# Altium schematic sheet LM3478.SchDoc: LM3478 High Voltage PWM Controller
size A4; Organization: Altium Limited; Revision: 1.0; SheetNumber: 1; SheetTotal: 1
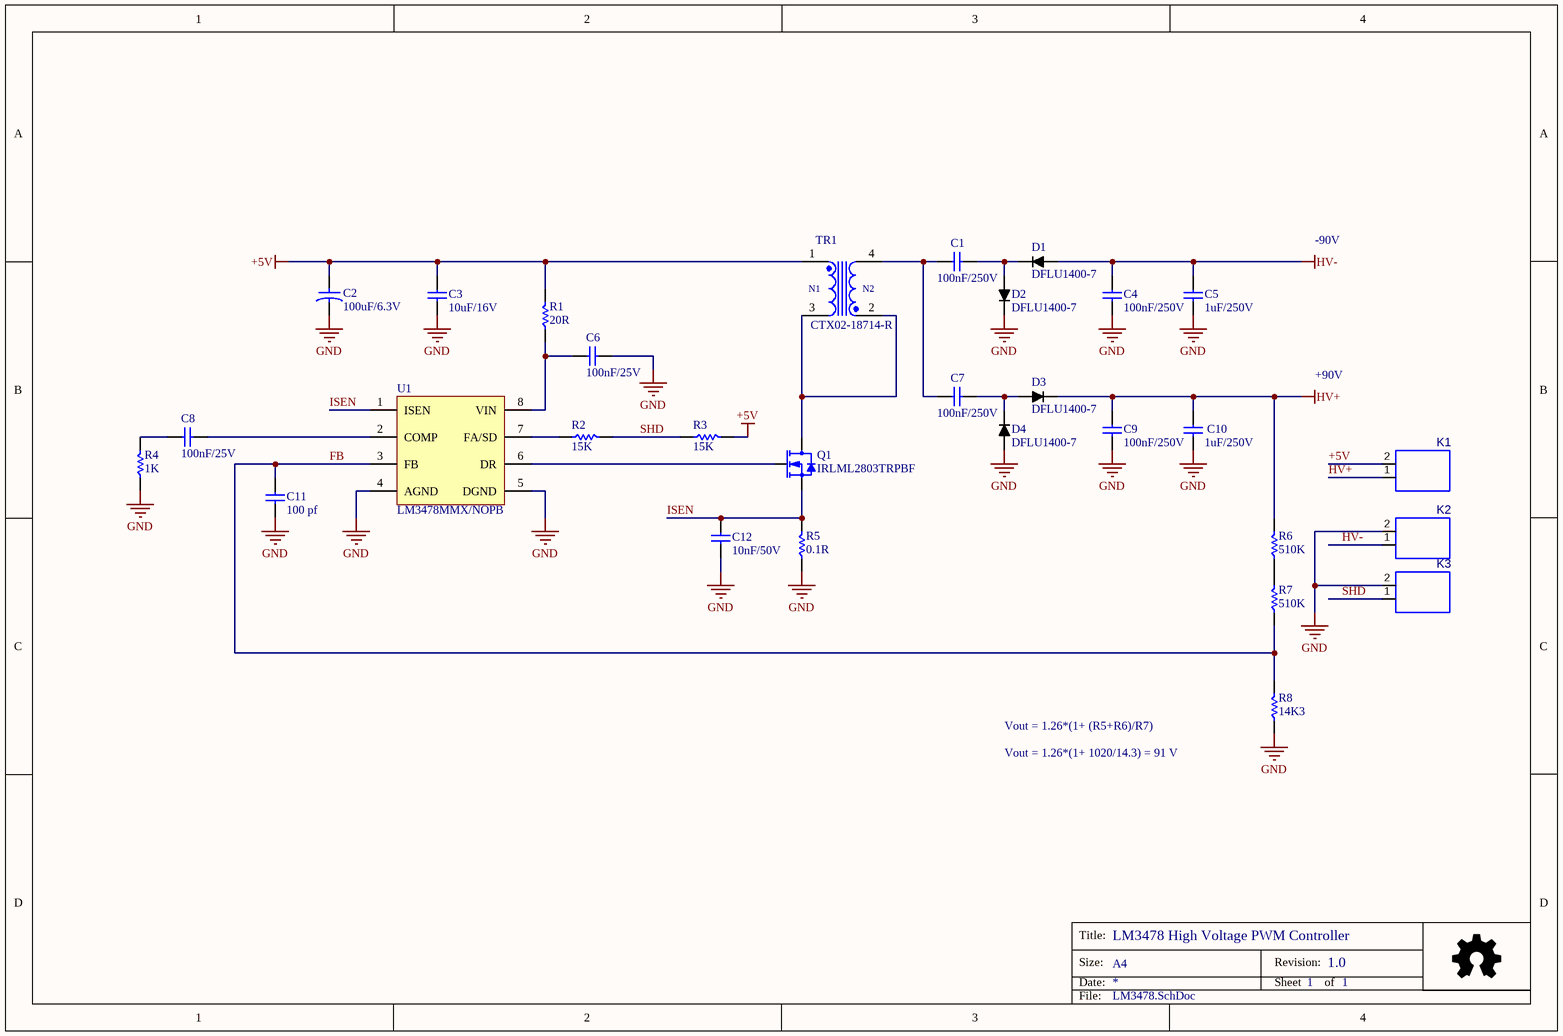
[diagram p0: LM3478.SchDoc]

## Parts
C1  100nF/250V  [CAP 0805/2012]
C2  100uF/6.3V  [CAP CASE C]
C3  10uF/16V  [CAP 1206/3216]
C4  100nF/250V  [CAP 0805/2012]
C5  1uF/250V  [CAP 2220/5650]
C6  100nF/25V  [CAP 0805/2012]
C7  100nF/250V  [CAP 0805/2012]
C8  100nF/25V  [CAP 0805/2012]
C9  100nF/250V  [CAP 0805/2012]
C10  1uF/250V  [CAP 2220/5650]
C11  100 pf  [CAP 0805/2012]
C12  10nF/50V  [CAP 0805/2012]
D1  DFLU1400-7  [POWERDI-123]
D2  DFLU1400-7  [POWERDI-123]
D3  DFLU1400-7  [POWERDI-123]
D4  DFLU1400-7  [POWERDI-123]
K1  1x2PLS  [JUMPER2]  (value not drawn)
K2  1x2PLS  [JUMPER2]  (value not drawn)
K3  1x2PLS  [JUMPER2]  (value not drawn)
Q1  IRLML2803TRPBF  [SOT-23-3]
R1  20R  [RES 0805/2012]
R2  15K  [RES 0805/2012]
R3  15K  [RES 0805/2012]
R4  1K  [RES 0805/2012]
R5  0.1R  [RES 0805/2012]
R6  510K  [RES 0805/2012]
R7  510K  [RES 0805/2012]
R8  14K3  [RES 0805/2012]
TR1  CTX02-18714-R  [CTX02-18714-R]
U1  LM3478MMX/NOPB  [MSOP-8]

## Nets
+5V: C2.1 C3.2 K1.2 R1.2 R3.2 TR1.1
GND: C2.2 C3.1 C4.1 C5.1 C6.2 C9.1 C10.1 C11.1 C12.1 D2.1(K) D4.2(A) K2.2 K3.2 R4.1 R5.1 R8.1 U1.4(AGND) U1.5(DGND)
HV+: C9.2 C10.2 D3.1(K) K1.1 R6.2
HV-: C4.2 C5.2 D1.2(A) K2.1
FB: C11.2 R7.1 R8.2 U1.3(FB)
ISEN: C12.2 Q1.2(S) R5.2 U1.1(ISEN)
SHD: K3.1 R2.2 R3.1
NetC1_1: C1.1 C7.1 TR1.4
NetC1_2: C1.2 D1.1(K) D2.2(A)
NetC6_1: C6.1 R1.1 U1.8(VIN)
NetC7_2: C7.2 D3.2(A) D4.1(K)
NetC8_1: C8.1 R4.2
NetC8_2: C8.2 U1.2(COMP)
NetQ1_1: Q1.1(G) U1.6(DR)
NetQ1_3: Q1.3(D) TR1.2 TR1.3
NetR2_1: R2.1 U1.7(FA/SD)
NetR6_1: R6.1 R7.2

## Notes on the sheet
- -90V
- +90V
- Vout = 1.26*(1+ (R5+R6)/R7)
- Vout = 1.26*(1+ 1020/14.3) = 91 V
- Title:
- Size:
- Date:
- A4
- Revision:
- Sheet
- of
- File:
- (in symbol CTX02-18714-R) N1; N2

## Library data of the parts
C1 C4 C7 C9 = CGA4J3X7T2E104K125AA: CAPACITOR 0805 100nF 250V, 10%, X7T; Manufacturer: TDK; Supplier 1: Farnell; Manufacturer Part Number: CGA4J3X7T2E104K125AA; Stock 1: 100000; Pricing 1: 2000=0.0796, 10000=0.0668 (EUR); Mount: Surface Mount; Case/Package: 0805; Weight: 0.000194oz; Case Code (Imperial): 0805; Case Code (Metric): 2012; Min Operating Temperature: -55°C; Max Operating Temperature: 125°C; Capacitance: 100nF; Tolerance: 10%; Dielectric: X7T; Termination: SMD/SMT; Voltage Rating (DC): 250V; Packaging: Tape and Reel; Voltage Rating: 250V; Package Quantity: 2000; Composition: Ceramic; Length: 2mm; Height: 1.25mm; Width: 1.25mm; Thickness: 0.057inch; Depth: 1.25mm; Ratings: AEC-Q200; Radiation Hardening: No; REACH SVHC: No SVHC; ComponentLink1URL: http://www.farnell.com/datasheets/1807242.pdf?src-supplier=Element14; ComponentLink1Description: http://www.farnell.com/datasheets/1807242.pdf?src-supplier=Element14; Value: 100nF/250V
C2 = TPSC107M006R0150: CAPACITOR 100uF 2312 6V3 TANT; Manufacturer: Kyocera AVX; Dielectric Material: Tantalum; Tolerance: 20%; ESR (Equivalent Series Resistance): 150mR; Voltage Rating: 6.3V; Leakage Current: 6.3uA; Polarity: Polar; Dissipation Factor: 6%; Supplier 1: Mouser; Manufacturer Part Number: TPSC107M006R0150; Stock 1: 4254; Pricing 1: 1=1.7, 10=1.16, 50=1.16, 100=0.896, 1000=0.6, 10000=0.51 (USD); Mount: Surface Mount,PCB; Case/Package: Molded; Case Code (Imperial): 2312; Case Code (Metric): 6032; Min Operating Temperature: -55°C; Max Operating Temperature: 125°C; Capacitance: 100uF; Packaging: Tape and Reel; Voltage Rating (DC): 6.3V; Package Quantity: 1; Termination: SMD/SMT; Voltage: 6.3V; Features: General Purpose; Length: 6mm; Height: 2.6mm; Width: 3.2mm; Depth: 3.2mm; Height - Seated (Max): 0.11inch; Lead Pitch: 2.9mm; Radiation Hardening: No; REACH SVHC: No SVHC; Lead Free: Lead Free; ComponentLink1URL: http://www.jameco.com/Jameco/Products/ProdDS/1938607.pdf?src-supplier=Jameco; ComponentLink1Description: http://www.jameco.com/Jameco/Products/ProdDS/1938607.pdf?src-supplier=Jameco; ComponentLink2URL: http://www.mouser.com/ds/2/40/tps-776850.pdf?src-supplier=Mouser; ComponentLink2Description: http://www.mouser.com/ds/2/40/tps-776850.pdf?src-supplier=Mouser; ComponentLink3URL: https://www.alliedelec.com/m/d/83cf44e04b230909adf636c7cda0f956.pdf?src-supplier=Allied+Electronics; ComponentLink3Description: https://www.alliedelec.com/m/d/83cf44e04b230909adf636c7cda0f956.pdf?src-supplier=Allied+Electronics; ComponentLink4URL: http://www.avx.com/docs/catalogs/tps.pdf?src-supplier=Avnet+Europe; ComponentLink4Description: http://www.avx.com/docs/catalogs/tps.pdf?src-supplier=Avnet+Europe; ComponentLink5URL: http://www.avx.com/docs/catalogs/tps.pdf?src-supplier=Avnet; ComponentLink5Description: http://www.avx.com/docs/catalogs/tps.pdf?src-supplier=Avnet; ComponentLink6URL: https://www.verical.com/server-webapp/html/getDatasheet?partID=92459&src-supplier=Verical; ComponentLink6Description: https://www.verical.com/server-webapp/html/getDatasheet?partID=92459&src-supplier=Verical; ComponentLink7URL: http://datasheets.avx.com/TPS.pdf?src-supplier=Digi-Key; ComponentLink7Description: http://datasheets.avx.com/TPS.pdf?src-supplier=Digi-Key; ComponentLink8URL: http://www.avxcorp.com/docs/Catalogs/tps.pdf?src-supplier=Future+Electronics; ComponentLink8Description: http://www.avxcorp.com/docs/Catalogs/tps.pdf?src-supplier=Future+Electronics; Value: 100uF/6.3V
C3 = GCM31CR71C106KA64L: CAPACITOR 1206 10uF 16V X7R 10%; Manufacturer: Murata; Supplier 1: Farnell; Manufacturer Part Number: GCM31CR71C106KA64L; Stock 1: 0; Pricing 1: 150=0.579, 250=0.528, 500=0.424 (EUR); Mount: Surface Mount; Case/Package: 1206; Case Code (Metric): 3216; Case Code (Imperial): 1206; Min Operating Temperature: -55°C; Max Operating Temperature: 125°C; Capacitance: 10uF; Tolerance: 10%; Dielectric: X7R; Packaging: Tape and Reel; Package Quantity: 1; Voltage Rating: 16V; Voltage Rating (DC): 16V; Termination: SMD/SMT; Voltage: 16V; Length: 3.2mm; Height: 1.6mm; Width: 0.063inch; Thickness: 0.071inch; Depth: 1.6mm; Ratings: AEC-Q200; Radiation Hardening: No; REACH SVHC: No SVHC; Lead Free: Lead Free; ComponentLink1URL: http://psearch.murata.com/capacitor/product/GCM31CR71C106KA64%23.pdf?src-supplier=Avnet; ComponentLink1Description: http://psearch.murata.com/capacitor/product/GCM31CR71C106KA64%23.pdf?src-supplier=Avnet; ComponentLink2URL: http://search.murata.co.jp/Ceramy/image/img/A01X/partnumbering_e_02.pdf?src-supplier=Digi-Key; ComponentLink2Description: http://search.murata.co.jp/Ceramy/image/img/A01X/partnumbering_e_02.pdf?src-supplier=Digi-Key; ComponentLink3URL: http://psearch.murata.com/capacitor/product/GCM31CR71C106KA64%23.pdf?src-supplier=Future+Electronics; ComponentLink3Description: http://psearch.murata.com/capacitor/product/GCM31CR71C106KA64%23.pdf?src-supplier=Future+Electronics; ComponentLink4URL: http://psearch.murata.com/capacitor/product/GCM31CR71C106KA64%23.pdf?src-supplier=Avnet+Europe; ComponentLink4Description: http://psearch.murata.com/capacitor/product/GCM31CR71C106KA64%23.pdf?src-supplier=Avnet+Europe; ComponentLink5URL: https://www.verical.com/server-webapp/html/getDatasheet?partID=153103&src-supplier=Verical; ComponentLink5Description: https://www.verical.com/server-webapp/html/getDatasheet?partID=153103&src-supplier=Verical; Value: 10uF/16V
C5 C10 = GRM55DR72E105KW01L: CAPACITOR 2220 1uF 250V X7R; Manufacturer: Murata; Material: Ceramic; Tolerance: 10%; Supplier 1: Farnell; Manufacturer Part Number: GRM55DR72E105KW01L; Stock 1: 0; Pricing 1: 1000=0.4 (EUR); Mount: Surface Mount; Case/Package: 2220; Number of Pins: 2; Case Code (Imperial): 2220; Case Code (Metric): 5750; Min Operating Temperature: -55°C; Max Operating Temperature: 125°C; Capacitance: 1uF; Dielectric: X7R; Voltage Rating: 250V; Packaging: Tape and Reel; Voltage Rating (DC): 250V; Package Quantity: 1; Termination: SMD/SMT; Voltage: 250V; Length: 5.7mm; Height: 2mm; Depth: 5mm; Width: 5mm; Thickness: 0.087inch; REACH SVHC: No SVHC; Lead Free: Lead Free; ComponentLink1URL: http://uk.rs-online.com/webdocs/1423/0900766b81423c41.pdf?src-supplier=RSComponents; ComponentLink1Description: http://uk.rs-online.com/webdocs/1423/0900766b81423c41.pdf?src-supplier=RSComponents; ComponentLink2URL: http://www.farnell.com/datasheets/608985.pdf?src-supplier=Element14; ComponentLink2Description: http://www.farnell.com/datasheets/608985.pdf?src-supplier=Element14; ComponentLink3URL: http://www.jameco.com/Jameco/Products/ProdDS/1859917.pdf?src-supplier=Jameco; ComponentLink3Description: http://www.jameco.com/Jameco/Products/ProdDS/1859917.pdf?src-supplier=Jameco; ComponentLink4URL: http://components.arrow.com/part/dataview/41900306S9850866N2606?src-supplier=Arrow; ComponentLink4Description: http://components.arrow.com/part/dataview/41900306S9850866N2606?src-supplier=Arrow; ComponentLink5URL: http://search.murata.co.jp/Ceramy/image/img/w_hinm/L0005E.pdf?src-supplier=Future+Electronics; ComponentLink5Description: http://search.murata.co.jp/Ceramy/image/img/w_hinm/L0005E.pdf?src-supplier=Future+Electronics; ComponentLink6URL: http://search.murata.co.jp/Ceramy/image/img/A01X/G101/ENG/GRM55DR72E105KW01-01.pdf?src-supplier=Digi-Key; ComponentLink6Description: http://search.murata.co.jp/Ceramy/image/img/A01X/G101/ENG/GRM55DR72E105KW01-01.pdf?src-supplier=Digi-Key; ComponentLink7URL: https://produktinfo.conrad.com/datenblaetter/450000-474999/452001-da-01-de-VS_KONDENS_GRM55_DR72E_105KW01L.pdf?src-supplier=Conrad; ComponentLink7Description: https://produktinfo.conrad.com/datenblaetter/450000-474999/452001-da-01-de-VS_KONDENS_GRM55_DR72E_105KW01L.pdf?src-supplier=Conrad; Value: 1uF/250V
C6 C8 = GRM21BR71E104KA01L: CAPACITOR 0805 100nF 25V X7R 10%; Manufacturer: Murata; Supplier 1: Farnell; Manufacturer Part Number: GRM21BR71E104KA01L; Stock 1: 0; Mount: Surface Mount; Case/Package: 0805; Number of Pins: 2; Weight: 0.000194oz; Case Code (Imperial): 0805; Case Code (Metric): 2012; Min Operating Temperature: -55°C; Max Operating Temperature: 125°C; Capacitance: 100nF; Tolerance: 10%; Dielectric: X7R; Voltage Rating: 25V; Voltage Rating (DC): 25V; Packaging: Tape and Reel; Package Quantity: 1; Termination: SMD/SMT; Voltage: 25V; Length: 2mm; Height: 1.25mm; Width: 1.25mm; Thickness: 0.053inch; Depth: 1.25mm; Radiation Hardening: No; REACH SVHC: No SVHC; Lead Free: Lead Free; ComponentLink1URL: http://psearch.murata.com/capacitor/product/GRM21BR71E104KA01%23.pdf?src-supplier=Future+Electronics; ComponentLink1Description: http://psearch.murata.com/capacitor/product/GRM21BR71E104KA01%23.pdf?src-supplier=Future+Electronics; ComponentLink2URL: https://search.murata.co.jp/Ceramy/image/img/A01X/G101/ENG/GRM21BR71E104KA01-01.pdf?src-supplier=Digi-Key; ComponentLink2Description: https://search.murata.co.jp/Ceramy/image/img/A01X/G101/ENG/GRM21BR71E104KA01-01.pdf?src-supplier=Digi-Key; ComponentLink3URL: http://www.farnell.com/datasheets/608985.pdf?src-supplier=Element14; ComponentLink3Description: http://www.farnell.com/datasheets/608985.pdf?src-supplier=Element14; ComponentLink4URL: http://components.arrow.com/part/dataview/5434837S9850839N2606?src-supplier=Arrow; ComponentLink4Description: http://components.arrow.com/part/dataview/5434837S9850839N2606?src-supplier=Arrow; ComponentLink5URL: http://uk.rs-online.com/webdocs/1423/0900766b81423cc8.pdf?src-supplier=RSComponents; ComponentLink5Description: http://uk.rs-online.com/webdocs/1423/0900766b81423cc8.pdf?src-supplier=RSComponents; Value: 100nF/25V
C11 = GRM216R71H102KA01D: CAPACITOR 0805 1nF 50V X7R 10%; Manufacturer: Murata; Material: Ceramic; Value: 1nF/50V; Supplier 1: Farnell; Manufacturer Part Number: GRM216R71H102KA01D; Stock 1: 0; Mount: Surface Mount; Case/Package: 0805; Number of Pins: 2; Case Code (Imperial): 0805; Case Code (Metric): 2012; Min Operating Temperature: -55°C; Max Operating Temperature: 125°C; Capacitance: 1nF; Tolerance: 10%; Dielectric: X7R; Voltage Rating: 50V; Voltage Rating (DC): 50V; Packaging: Tape and Reel; Package Quantity: 4000; Termination: SMD/SMT; Voltage: 50V; Length: 2mm; Height: 0.6mm; Depth: 1.25mm; Width: 1.25mm; Thickness: 0.028inch; Radiation Hardening: No; REACH SVHC: No SVHC; Lead Free: Lead Free; ComponentLink1URL: http://www1.futureelectronics.com/doc/Murata/murata%20GRM216R71H102KA01D.pdf?src-supplier=Future+Electronics; ComponentLink1Description: http://www1.futureelectronics.com/doc/Murata/murata%20GRM216R71H102KA01D.pdf?src-supplier=Future+Electronics; ComponentLink2URL: http://www.rapidonline.com/pdf/71-2004.pdf?src-supplier=Rapid+Electronics; ComponentLink2Description: http://www.rapidonline.com/pdf/71-2004.pdf?src-supplier=Rapid+Electronics; ComponentLink3URL: https://www.murata.com/~/media/webrenewal/support/library/catalog/products/capacitor/mlcc/c02e.ashx?la=en-us&src-supplier=Digi-Key; ComponentLink3Description: https://www.murata.com/~/media/webrenewal/support/library/catalog/products/capacitor/mlcc/c02e.ashx?la=en-us&src-supplier=Digi-Key; ComponentLink4URL: https://www.distrelec.biz/Web/Downloads/_t/ds/murata_MLCC_eng_tds.pdf?mime=application%2Fpdf&src-supplier=Distrelec; ComponentLink4Description: https://www.distrelec.biz/Web/Downloads/_t/ds/murata_MLCC_eng_tds.pdf?mime=application%2Fpdf&src-supplier=Distrelec; ComponentLink5URL: http://www.murata.com/~/media/webrenewal/support/library/catalog/products/capacitor/mlcc/c02e.ashx?src-supplier=Avnet; ComponentLink5Description: http://www.murata.com/~/media/webrenewal/support/library/catalog/products/capacitor/mlcc/c02e.ashx?src-supplier=Avnet; ComponentLink6URL: http://www.murata.com/products/catalog/pdf/c02e.pdf?src-supplier=Avnet; ComponentLink6Description: http://www.murata.com/products/catalog/pdf/c02e.pdf?src-supplier=Avnet; ComponentLink7URL: http://search.murata.co.jp/Ceramy/image/img/A01X/partnumbering_e_01.pdf?src-supplier=Digi-Key; ComponentLink7Description: http://search.murata.co.jp/Ceramy/image/img/A01X/partnumbering_e_01.pdf?src-supplier=Digi-Key; ComponentLink8URL: http://www.murata.com/products/catalog/pdf/c02e.pdf?src-supplier=Avnet+Europe; ComponentLink8Description: http://www.murata.com/products/catalog/pdf/c02e.pdf?src-supplier=Avnet+Europe; ComponentLink9URL: http://components.arrow.com/part/dataview/40420870S3442898N2606?src-supplier=Arrow; ComponentLink9Description: http://components.arrow.com/part/dataview/40420870S3442898N2606?src-supplier=Arrow; ComponentLink10URL: http://www.farnell.com/datasheets/2048646.pdf?src-supplier=Element14; ComponentLink10Description: http://www.farnell.com/datasheets/2048646.pdf?src-supplier=Element14; ComponentLink11URL: https://produktinfo.conrad.com/datenblaetter/450000-474999/452509-da-01-en-VS_KONDENSATOR_0805.pdf?src-supplier=Conrad; ComponentLink11Description: https://produktinfo.conrad.com/datenblaetter/450000-474999/452509-da-01-en-VS_KONDENSATOR_0805.pdf?src-supplier=Conrad
C12 = GRM216R71H103JA01D: CAPACITOR 0805 10nF 50V X7R 5%; Manufacturer: Murata; Dielectric Material: Ceramic; Insulation Resistance: 10GR; Supplier 1: Farnell; Manufacturer Part Number: GRM216R71H103JA01D; Stock 1: 0; Mount: Surface Mount; Case/Package: 0805; Number of Pins: 2; Case Code (Imperial): 0805; Case Code (Metric): 2012; Min Operating Temperature: -55°C; Max Operating Temperature: 125°C; Capacitance: 10nF; Tolerance: 5%; Dielectric: X7R; Voltage Rating: 50V; Packaging: Tape and Reel; Voltage Rating (DC): 50V; Package Quantity: 4000; Termination: SMD/SMT; Voltage: 50V; Length: 2mm; Height: 0.6mm; Depth: 1.25mm; Width: 1.25mm; Thickness: 0.028inch; Radiation Hardening: No; REACH SVHC: No SVHC; Lead Free: Lead Free; ComponentLink1URL: http://www.mouser.com/ds/2/281/c02e-2905.pdf?src-supplier=Mouser; ComponentLink1Description: http://www.mouser.com/ds/2/281/c02e-2905.pdf?src-supplier=Mouser; ComponentLink2URL: http://search.murata.co.jp/Ceramy/image/img/A01X/partnumbering_e_01.pdf?src-supplier=Digi-Key; ComponentLink2Description: http://search.murata.co.jp/Ceramy/image/img/A01X/partnumbering_e_01.pdf?src-supplier=Digi-Key; ComponentLink3URL: http://components.arrow.com/part/dataview/5432629S9717172N2606?src-supplier=Arrow; ComponentLink3Description: http://components.arrow.com/part/dataview/5432629S9717172N2606?src-supplier=Arrow; ComponentLink4URL: https://www.murata.com/~/media/webrenewal/support/library/catalog/products/capacitor/mlcc/c02e.ashx?la=en-us&src-supplier=Digi-Key; ComponentLink4Description: https://www.murata.com/~/media/webrenewal/support/library/catalog/products/capacitor/mlcc/c02e.ashx?la=en-us&src-supplier=Digi-Key; ComponentLink5URL: http://www.farnell.com/datasheets/4360.pdf?src-supplier=Element14; ComponentLink5Description: http://www.farnell.com/datasheets/4360.pdf?src-supplier=Element14; Value: 10nF/50V
D1-D4 = DFLU1400-7: DIODE 400V 1A POWERDI123; Manufacturer: Diodes; Peak Reverse Current: 5uA; Reverse Recovery Time: 25ns; Peak Non-Repetitive Surge Current: 30A; Element Configuration: Single; Forward Voltage: 1.25V; Max Power Dissipation: 1W; Polarity: Standard; Capacitance: 14pF; Supplier 1: Farnell; Manufacturer Part Number: DFLU1400-7; Stock 1: 0; Pricing 1: 150=0.192, 250=0.17, 500=0.148, 1000=0.126, 5000=0.124 (EUR); Mount: Surface Mount; Number of Pins: 2; Weight: 0.000353oz; Contact Plating: Tin,Matte; Min Operating Temperature: -65°C; Max Operating Temperature: 150°C; Forward Current: 1A; Max Repetitive Reverse Voltage (Vrrm): 400V; Max Surge Current: 30A; Packaging: Tape and Reel; Package Quantity: 3000; Recovery Time: 25ns; Reverse Voltage (DC): 400V; Average Rectified Current: 1A; Max Forward Surge Current (Ifsm): 30A; Voltage Rating (DC): 400V; Current Rating: 1A; Output Current: 1A; Max Reverse Voltage (DC): 400V; Length: 2.8mm; Height: 0.98mm; Width: 1.78mm; Radiation Hardening: No; REACH SVHC: No SVHC; Lead Free: Lead Free; ComponentLink1URL: http://www.diodes.com///datasheets/ds30784.pdf?src-supplier=Avnet+Europe; ComponentLink1Description: http://www.diodes.com///datasheets/ds30784.pdf?src-supplier=Avnet+Europe; ComponentLink2URL: http://www.mouser.com/ds/2/115/ds30784-86750.pdf?src-supplier=Mouser; ComponentLink2Description: http://www.mouser.com/ds/2/115/ds30784-86750.pdf?src-supplier=Mouser; ComponentLink3URL: http://www.diodes.com///datasheets/ds30784.pdf?src-supplier=Avnet; ComponentLink3Description: http://www.diodes.com///datasheets/ds30784.pdf?src-supplier=Avnet; ComponentLink4URL: https://www.diodes.com/assets/Datasheets/ds30784.pdf?src-supplier=Digi-Key; ComponentLink4Description: https://www.diodes.com/assets/Datasheets/ds30784.pdf?src-supplier=Digi-Key; ComponentLink5URL: http://www.diodes.com/_files/datasheets/ds30784.pdf?src-supplier=Future+Electronics; ComponentLink5Description: http://www.diodes.com/_files/datasheets/ds30784.pdf?src-supplier=Future+Electronics
Q1 = IRLML2803TRPBF: MOSFET N-CH 30V 1.2A 3-Pin SOT-23 T/R; Manufacturer: International Rectifier; Gate to Source Voltage (Vgs): 20V; Rise Time: 4ns; Turn-On Delay Time: 3.9ns; Turn-Off Delay Time: 9ns; Fall Time: 1.7ns; Nominal Vgs: 1V; Rds On Max: 250mR; Input Capacitance: 85pF; Number of Elements: 1; Max Power Dissipation: 540mW; Drain to Source Resistance: 400mR; Element Configuration: Single; Supplier 1: Farnell; Manufacturer Part Number: IRLML2803TRPBF; Stock 1: 0; Mount: Surface Mount; Case/Package: SOT-23; Number of Pins: 3; Min Operating Temperature: -55°C; Max Operating Temperature: 150°C; Continuous Drain Current (ID): 1.2A; Drain to Source Voltage (Vdss): 30V; Packaging: Tape and Reel; Package Quantity: 1; Dual Supply Voltage: 30V; Drain to Source Breakdown Voltage: 30V; Power Dissipation: 540mW; On-State Resistance: 250mR; Min Breakdown Voltage: 30V; Termination: SMD/SMT; Threshold Voltage: 1V; Voltage Rating (DC): 30V; Current Rating: 1.2A; Length: 3.04mm; Height: 1.02mm; Width: 1.4mm; Radiation Hardening: No; Lead Free: Lead Free; REACH SVHC: No SVHC; ComponentLink1URL: http://www.jameco.com/Jameco/Products/ProdDS/1563665.pdf?src-supplier=Jameco; ComponentLink1Description: http://www.jameco.com/Jameco/Products/ProdDS/1563665.pdf?src-supplier=Jameco; ComponentLink2URL: http://www.irf.com/product-info/datasheets/data/irlml2803pbf.pdf?src-supplier=Future+Electronics; ComponentLink2Description: http://www.irf.com/product-info/datasheets/data/irlml2803pbf.pdf?src-supplier=Future+Electronics; ComponentLink3URL: http://www.irf.com/product-info/datasheets/data/irlml2803pbf.pdf?src-supplier=Digi-Key; ComponentLink3Description: http://www.irf.com/product-info/datasheets/data/irlml2803pbf.pdf?src-supplier=Digi-Key; ComponentLink4URL: https://www.infineon.com/dgdl/irlml2803pbf.pdf?fileId=5546d462533600a4015356682aff260f&src-supplier=Digi-Key; ComponentLink4Description: https://www.infineon.com/dgdl/irlml2803pbf.pdf?fileId=5546d462533600a4015356682aff260f&src-supplier=Digi-Key; ComponentLink5URL: http://www.irf.com/product-info/datasheets/data/irlml2803pbf.pdf?src-supplier=Farnell; ComponentLink5Description: http://www.irf.com/product-info/datasheets/data/irlml2803pbf.pdf?src-supplier=Farnell; ComponentLink6URL: http://www.produktinfo.conrad.com/datenblaetter/150000-174999/162828-da-01-en-IRLML_2803TR.pdf?src-supplier=Conrad; ComponentLink6Description: http://www.produktinfo.conrad.com/datenblaetter/150000-174999/162828-da-01-en-IRLML_2803TR.pdf?src-supplier=Conrad
R1 = ERJ6ENF20R0V: RESISTOR 0805 20R 1%; Manufacturer: Panasonic; Manufacturer Part Number: ERJ-6ENF20R0V; Temperature Coefficient: 100ppm/°C; Power Rating: 125mW; Voltage Rating: 150V; Supplier 1: Farnell; Stock 1: 0; Mount: Surface Mount; Case/Package: 0805; Weight: 0.000194oz; Contact Plating: Tin; Case Code (Metric): 2012; Case Code (Imperial): 0805; Min Operating Temperature: -55°C; Max Operating Temperature: 155°C; Resistance: 20R; Tolerance: 1%; Composition: Thick Film; Packaging: Tape and Reel; Package Quantity: 5000; Number of Terminations: 2; Termination: SMD/SMT; Military Standard: Not; Max Power Dissipation: 125mW; Length: 2mm; Height: 0.6mm; Width: 0.049inch; Depth: 1.25mm; Radiation Hardening: No; REACH SVHC: No SVHC; ComponentLink1URL: http://industrial.panasonic.com/www-data/pdf/AOA0000/AOA0000CE2.pdf?src-supplier=Avnet+Asia; ComponentLink1Description: http://industrial.panasonic.com/www-data/pdf/AOA0000/AOA0000CE2.pdf?src-supplier=Avnet+Asia; ComponentLink2URL: http://www.alliedelec.com/m/d/623f45ff1957d936ff56d46fd1c28cac.pdf?src-supplier=Allied+Electronics; ComponentLink2Description: http://www.alliedelec.com/m/d/623f45ff1957d936ff56d46fd1c28cac.pdf?src-supplier=Allied+Electronics; ComponentLink3URL: http://www.mouser.com/ds/2/315/AOA0000C86-911473.pdf?src-supplier=Mouser; ComponentLink3Description: http://www.mouser.com/ds/2/315/AOA0000C86-911473.pdf?src-supplier=Mouser; ComponentLink4URL: http://industrial.panasonic.com/www-data/pdf/AOA0000/AOA0000CE2.pdf?src-supplier=Avnet; ComponentLink4Description: http://industrial.panasonic.com/www-data/pdf/AOA0000/AOA0000CE2.pdf?src-supplier=Avnet; ComponentLink5URL: http://www.farnell.com/datasheets/426256.pdf?src-supplier=Element14; ComponentLink5Description: http://www.farnell.com/datasheets/426256.pdf?src-supplier=Element14; ComponentLink6URL: http://www.farnell.com/datasheets/1678782.pdf?src-supplier=Element14; ComponentLink6Description: http://www.farnell.com/datasheets/1678782.pdf?src-supplier=Element14; ComponentLink7URL: http://industrial.panasonic.com/www-data/pdf/AOA0000/AOA0000CE2.pdf?src-supplier=Avnet+Europe; ComponentLink7Description: http://industrial.panasonic.com/www-data/pdf/AOA0000/AOA0000CE2.pdf?src-supplier=Avnet+Europe
R2 R3 = ERJ6ENF1502V: RESISTOR 0805 15K 1%; Manufacturer: Panasonic; Manufacturer Part Number: ERJ-6ENF1502V; Temperature Coefficient: 100ppm/°C; Power Rating: 125mW; Voltage Rating: 150V; Supplier 1: Farnell; Stock 1: 0; Mount: Surface Mount; Case/Package: 0805; Number of Pins: 2; Contact Plating: Tin; Case Code (Imperial): 0805; Case Code (Metric): 2012; Min Operating Temperature: -55°C; Max Operating Temperature: 155°C; Resistance: 15K; Tolerance: 1%; Composition: Thick Film; Packaging: Tape and Reel; Package Quantity: 1; Termination: SMD/SMT; Number of Terminations: 2; Military Standard: Not; Max Power Dissipation: 125mW; Voltage Rating (DC): 150V; Features: Automotive AEC-Q200; Length: 2mm; Height: 0.6mm; Width: 1.2mm; Depth: 1.25mm; Radiation Hardening: No; REACH SVHC: No SVHC; Lead Free: Lead Free; ComponentLink1URL: http://industrial.panasonic.com/www-data/pdf/AOA0000/AOA0000CE2.pdf?src-supplier=Future+Electronics; ComponentLink1Description: http://industrial.panasonic.com/www-data/pdf/AOA0000/AOA0000CE2.pdf?src-supplier=Future+Electronics; ComponentLink2URL: https://www.alliedelec.com/m/d/623f45ff1957d936ff56d46fd1c28cac.pdf?src-supplier=Allied+Electronics; ComponentLink2Description: https://www.alliedelec.com/m/d/623f45ff1957d936ff56d46fd1c28cac.pdf?src-supplier=Allied+Electronics; ComponentLink3URL: http://industrial.panasonic.com/www-data/pdf/AOA0000/AOA0000CE2.pdf?src-supplier=Avnet+Asia; ComponentLink3Description: http://industrial.panasonic.com/www-data/pdf/AOA0000/AOA0000CE2.pdf?src-supplier=Avnet+Asia; ComponentLink4URL: http://www.farnell.com/datasheets/1678782.pdf?src-supplier=Element14; ComponentLink4Description: http://www.farnell.com/datasheets/1678782.pdf?src-supplier=Element14; ComponentLink5URL: http://www.farnell.com/datasheets/1911175.pdf?src-supplier=Farnell; ComponentLink5Description: http://www.farnell.com/datasheets/1911175.pdf?src-supplier=Farnell; ComponentLink6URL: http://www.jameco.com/Jameco/Products/ProdDS/1989076.pdf?src-supplier=Jameco; ComponentLink6Description: http://www.jameco.com/Jameco/Products/ProdDS/1989076.pdf?src-supplier=Jameco; ComponentLink7URL: http://www.farnell.com/datasheets/426256.pdf?src-supplier=Element14; ComponentLink7Description: http://www.farnell.com/datasheets/426256.pdf?src-supplier=Element14
R4 = ERJ6ENF1001V: RESISTOR 0805 1K 1%; Manufacturer: Panasonic; Manufacturer Part Number: ERJ-6ENF1001V; Temperature Coefficient: 100ppm/°C; Power Rating: 125mW; Voltage Rating (DC): 150V; Supplier 1: Farnell; Stock 1: 0; Mount: Surface Mount; Case/Package: 0805; Number of Pins: 2; Min Operating Temperature: -55°C; Max Operating Temperature: 155°C; Resistance: 1K; Tolerance: 1%; Packaging: Cut Tape; Number of Terminations: 2; Working Voltage: 150V; Length: 2mm; Height: 0.6mm; Depth: 1.25mm; Width: 1.25mm; REACH SVHC: No SVHC; Lead Free: Lead Free
R5 = ERJ6RSFR10V: RESISTOR 0805 0.1R 1%; Manufacturer: Panasonic; Temperature Coefficient: 250ppm/°C; Power Rating: 125mW; Supplier 1: Arrow; Manufacturer Part Number: ERJ6RSFR10V; Stock 1: 9768; Mount: Surface Mount; Case/Package: 0805; Number of Pins: 2; Contact Plating: Tin; Case Code (Imperial): 0805; Case Code (Metric): 2012; Min Operating Temperature: -55°C; Max Operating Temperature: 125°C; Tolerance: 1%; Resistance: 0.1R; Composition: Thick Film; Package Quantity: 5000; Packaging: Tape and Reel; Termination: SMD/SMT; Military Standard: Not; Length: 2mm; Height: 0.6mm; Width: 1.2mm; Depth: 1.25mm; Radiation Hardening: No; REACH SVHC: No SVHC; Lead Free: Lead Free; ComponentLink1URL: http://uk.rs-online.com/webdocs/13b8/0900766b813b869e.pdf?src-supplier=RSComponents; ComponentLink1Description: http://uk.rs-online.com/webdocs/13b8/0900766b813b869e.pdf?src-supplier=RSComponents; ComponentLink2URL: http://industrial.panasonic.com/www-data/pdf/AOA0000/AOA0000CE3.pdf?src-supplier=Avnet+Europe; ComponentLink2Description: http://industrial.panasonic.com/www-data/pdf/AOA0000/AOA0000CE3.pdf?src-supplier=Avnet+Europe; ComponentLink3URL: http://www.mouser.com/ds/2/315/AOA0000C295-1109214.pdf?src-supplier=Mouser; ComponentLink3Description: http://www.mouser.com/ds/2/315/AOA0000C295-1109214.pdf?src-supplier=Mouser; ComponentLink4URL: http://www.farnell.com/datasheets/391509.pdf?src-supplier=Element14; ComponentLink4Description: http://www.farnell.com/datasheets/391509.pdf?src-supplier=Element14; ComponentLink5URL: http://industrial.panasonic.com/www-data/pdf/AOA0000/AOA0000CE3.pdf?src-supplier=Avnet; ComponentLink5Description: http://industrial.panasonic.com/www-data/pdf/AOA0000/AOA0000CE3.pdf?src-supplier=Avnet; ComponentLink6URL: http://industrial.panasonic.com/cdbs/www-data/pdf/RDN0000/AOA0000C313.pdf?src-supplier=Farnell; ComponentLink6Description: http://industrial.panasonic.com/cdbs/www-data/pdf/RDN0000/AOA0000C313.pdf?src-supplier=Farnell
R6 R7 = ERJ6ENF5103V: RESISTOR 0805 510K 1%; Manufacturer: Panasonic; Temperature Coefficient: 100ppm/°C; Power Rating: 125mW; Voltage Rating: 150V; Supplier 1: Farnell; Manufacturer Part Number: ERJ6ENF5103V; Stock 1: 0; Mount: Surface Mount; Case/Package: 0805; Contact Plating: Tin; Case Code (Metric): 2012; Case Code (Imperial): 0805; Min Operating Temperature: -55°C; Max Operating Temperature: 155°C; Resistance: 510K; Tolerance: 1%; Composition: Thick Film; Packaging: Tape and Reel; Package Quantity: 1; Number of Terminations: 2; Termination: SMD/SMT; Military Standard: Not; Max Power Dissipation: 125mW; Voltage Rating (DC): 150V; Features: Automotive AEC-Q200; Length: 2mm; Height: 0.6mm; Width: 0.049inch; Depth: 1.25mm; Radiation Hardening: No; REACH SVHC: No SVHC; Lead Free: Lead Free; ComponentLink1URL: http://industrial.panasonic.com/www-data/pdf/AOA0000/AOA0000CE2.pdf?src-supplier=Avnet+Europe; ComponentLink1Description: http://industrial.panasonic.com/www-data/pdf/AOA0000/AOA0000CE2.pdf?src-supplier=Avnet+Europe; ComponentLink2URL: http://www.farnell.com/datasheets/1678782.pdf?src-supplier=Farnell; ComponentLink2Description: http://www.farnell.com/datasheets/1678782.pdf?src-supplier=Farnell; ComponentLink3URL: http://www.mouser.com/ds/2/315/AOA0000C283-1093288.pdf?src-supplier=Mouser; ComponentLink3Description: http://www.mouser.com/ds/2/315/AOA0000C283-1093288.pdf?src-supplier=Mouser; ComponentLink4URL: http://www.farnell.com/datasheets/1678782.pdf?src-supplier=Element14; ComponentLink4Description: http://www.farnell.com/datasheets/1678782.pdf?src-supplier=Element14; ComponentLink5URL: http://industrial.panasonic.com/www-data/pdf/AOA0000/AOA0000CE2.pdf?src-supplier=Avnet; ComponentLink5Description: http://industrial.panasonic.com/www-data/pdf/AOA0000/AOA0000CE2.pdf?src-supplier=Avnet
R8 = ERJ6ENF6491V: RESISTOR 0805 6K49 1%; Manufacturer: Panasonic; Manufacturer Part Number: ERJ-6ENF6491V; Power Rating: 125mW; Voltage Rating: 150V; Temperature Coefficient: 100ppm/°C; Supplier 1: Farnell; Stock 1: 0; Mount: Surface Mount; Case/Package: 0805; Case Code (Imperial): 0805; Case Code (Metric): 2012; Contact Plating: Tin; Min Operating Temperature: -55°C; Max Operating Temperature: 155°C; Resistance: 6K49; Tolerance: 1%; Packaging: Tape and Reel; Package Quantity: 1; Composition: Thick Film; Number of Terminations: 2; Termination: SMD/SMT; Military Standard: Not; Max Power Dissipation: 125mW; Voltage Rating (DC): 150V; Features: Automotive AEC-Q200; Length: 2mm; Height: 0.6mm; Width: 1.2mm; Depth: 1.25mm; REACH SVHC: Yes; Lead Free: Lead Free; ComponentLink1URL: http://www.alliedelec.com/m/d/623f45ff1957d936ff56d46fd1c28cac.pdf?src-supplier=Allied+Electronics; ComponentLink1Description: http://www.alliedelec.com/m/d/623f45ff1957d936ff56d46fd1c28cac.pdf?src-supplier=Allied+Electronics; ComponentLink2URL: http://industrial.panasonic.com/www-data/pdf/AOA0000/AOA0000CE2.pdf?src-supplier=Avnet; ComponentLink2Description: http://industrial.panasonic.com/www-data/pdf/AOA0000/AOA0000CE2.pdf?src-supplier=Avnet; ComponentLink3URL: http://www.farnell.com/datasheets/1678782.pdf?src-supplier=Element14; ComponentLink3Description: http://www.farnell.com/datasheets/1678782.pdf?src-supplier=Element14; ComponentLink4URL: https://www.alliedelec.com/m/d/623f45ff1957d936ff56d46fd1c28cac.pdf?src-supplier=Allied+Electronics; ComponentLink4Description: https://www.alliedelec.com/m/d/623f45ff1957d936ff56d46fd1c28cac.pdf?src-supplier=Allied+Electronics
TR1 = CTX02-18714-R: COUPLED INDUCTOR 1:4; Manufacturer: Eaton Cooper; Number of Coils: 2; Shielding: Unshielded; Secondary Current: 1mA; Turns Ratio: 1:4.034; Primary Winding(s): Single; Supplier 1: Mouser; Manufacturer Part Number: CTX02-18714-R; Stock 1: 2183; Mount: Surface Mount; Case/Package: Nonstandard; Weight: 0.016oz; Min Operating Temperature: -40°C; Max Operating Temperature: 85°C; Package Quantity: 1350; Packaging: Tape and Reel; Termination: Solder; Secondary Winding(s): Single; Length: 0.299inch; Height: 0.171inch; Width: 0.299inch; ComponentLink1URL: https://media.digikey.com/pdf/Data%20Sheets/Coiltronics%20PDFs/CTX02-18714-R.pdf?src-supplier=Digi-Key; ComponentLink1Description: https://media.digikey.com/pdf/Data%20Sheets/Coiltronics%20PDFs/CTX02-18714-R.pdf?src-supplier=Digi-Key; ComponentLink2URL: http://www.mouser.com/ds/2/87/BUS_Elx_PM_4314_ECONO_PAC_OCTA_PAC_PLUS-258364.pdf?src-supplier=Mouser; ComponentLink2Description: http://www.mouser.com/ds/2/87/BUS_Elx_PM_4314_ECONO_PAC_OCTA_PAC_PLUS-258364.pdf?src-supplier=Mouser
U1 = LM3478MMX/NOPB: DC/DC Controller 2.97V to 40V Input; Manufacturer: TI National Semiconductor; Number of Outputs: 1; Output Voltage: 1.26V; Output Current: 1A; Switching Frequency: 1MHz; Max Duty Cycle: 100%; Quiescent Current: 2.7mA; Supplier 1: Farnell; Manufacturer Part Number: LM3478MMX/NOPB; Stock 1: 0; Mount: Surface Mount; Case/Package: MSOP; Number of Pins: 8; Contact Plating: Tin,Matte; Min Operating Temperature: -40°C; Max Operating Temperature: 125°C; Operating Supply Voltage: 40V; Packaging: Tape and Reel; Max Frequency: 1MHz; Duty Cycle: 100%; Radiation Hardening: No; Lead Free: Lead Free; ComponentLink1URL: http://www.ti.com/lit/ds/symlink/lm3478.pdf?src-supplier=Digi-Key; ComponentLink1Description: http://www.ti.com/lit/ds/symlink/lm3478.pdf?src-supplier=Digi-Key
K1-K3 = 1x2PLS: Value: *